# Altium schematic sheet TCAN1146_PWR_MGMT.SchDoc
size C; SheetNumber: 3; SheetTotal: 7
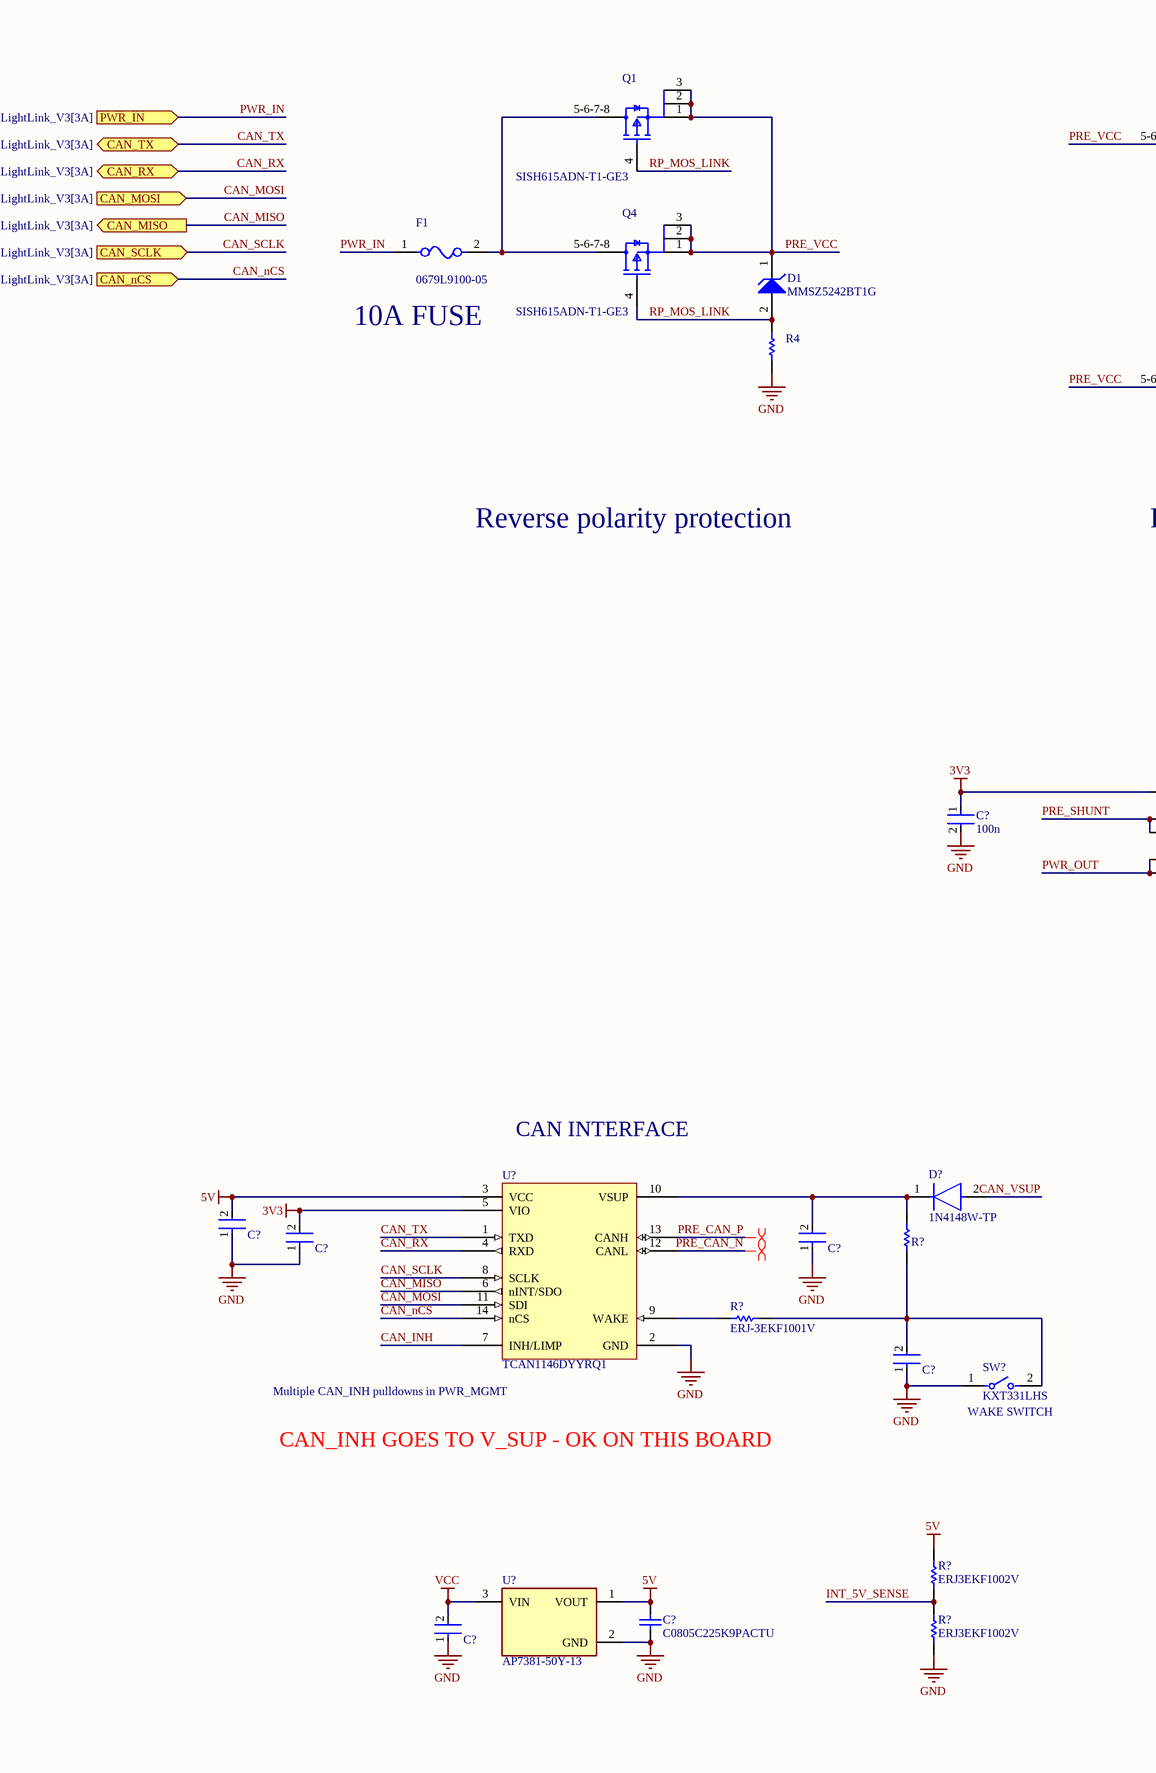
[diagram p0: TCAN1146_PWR_MGMT.SchDoc, left]
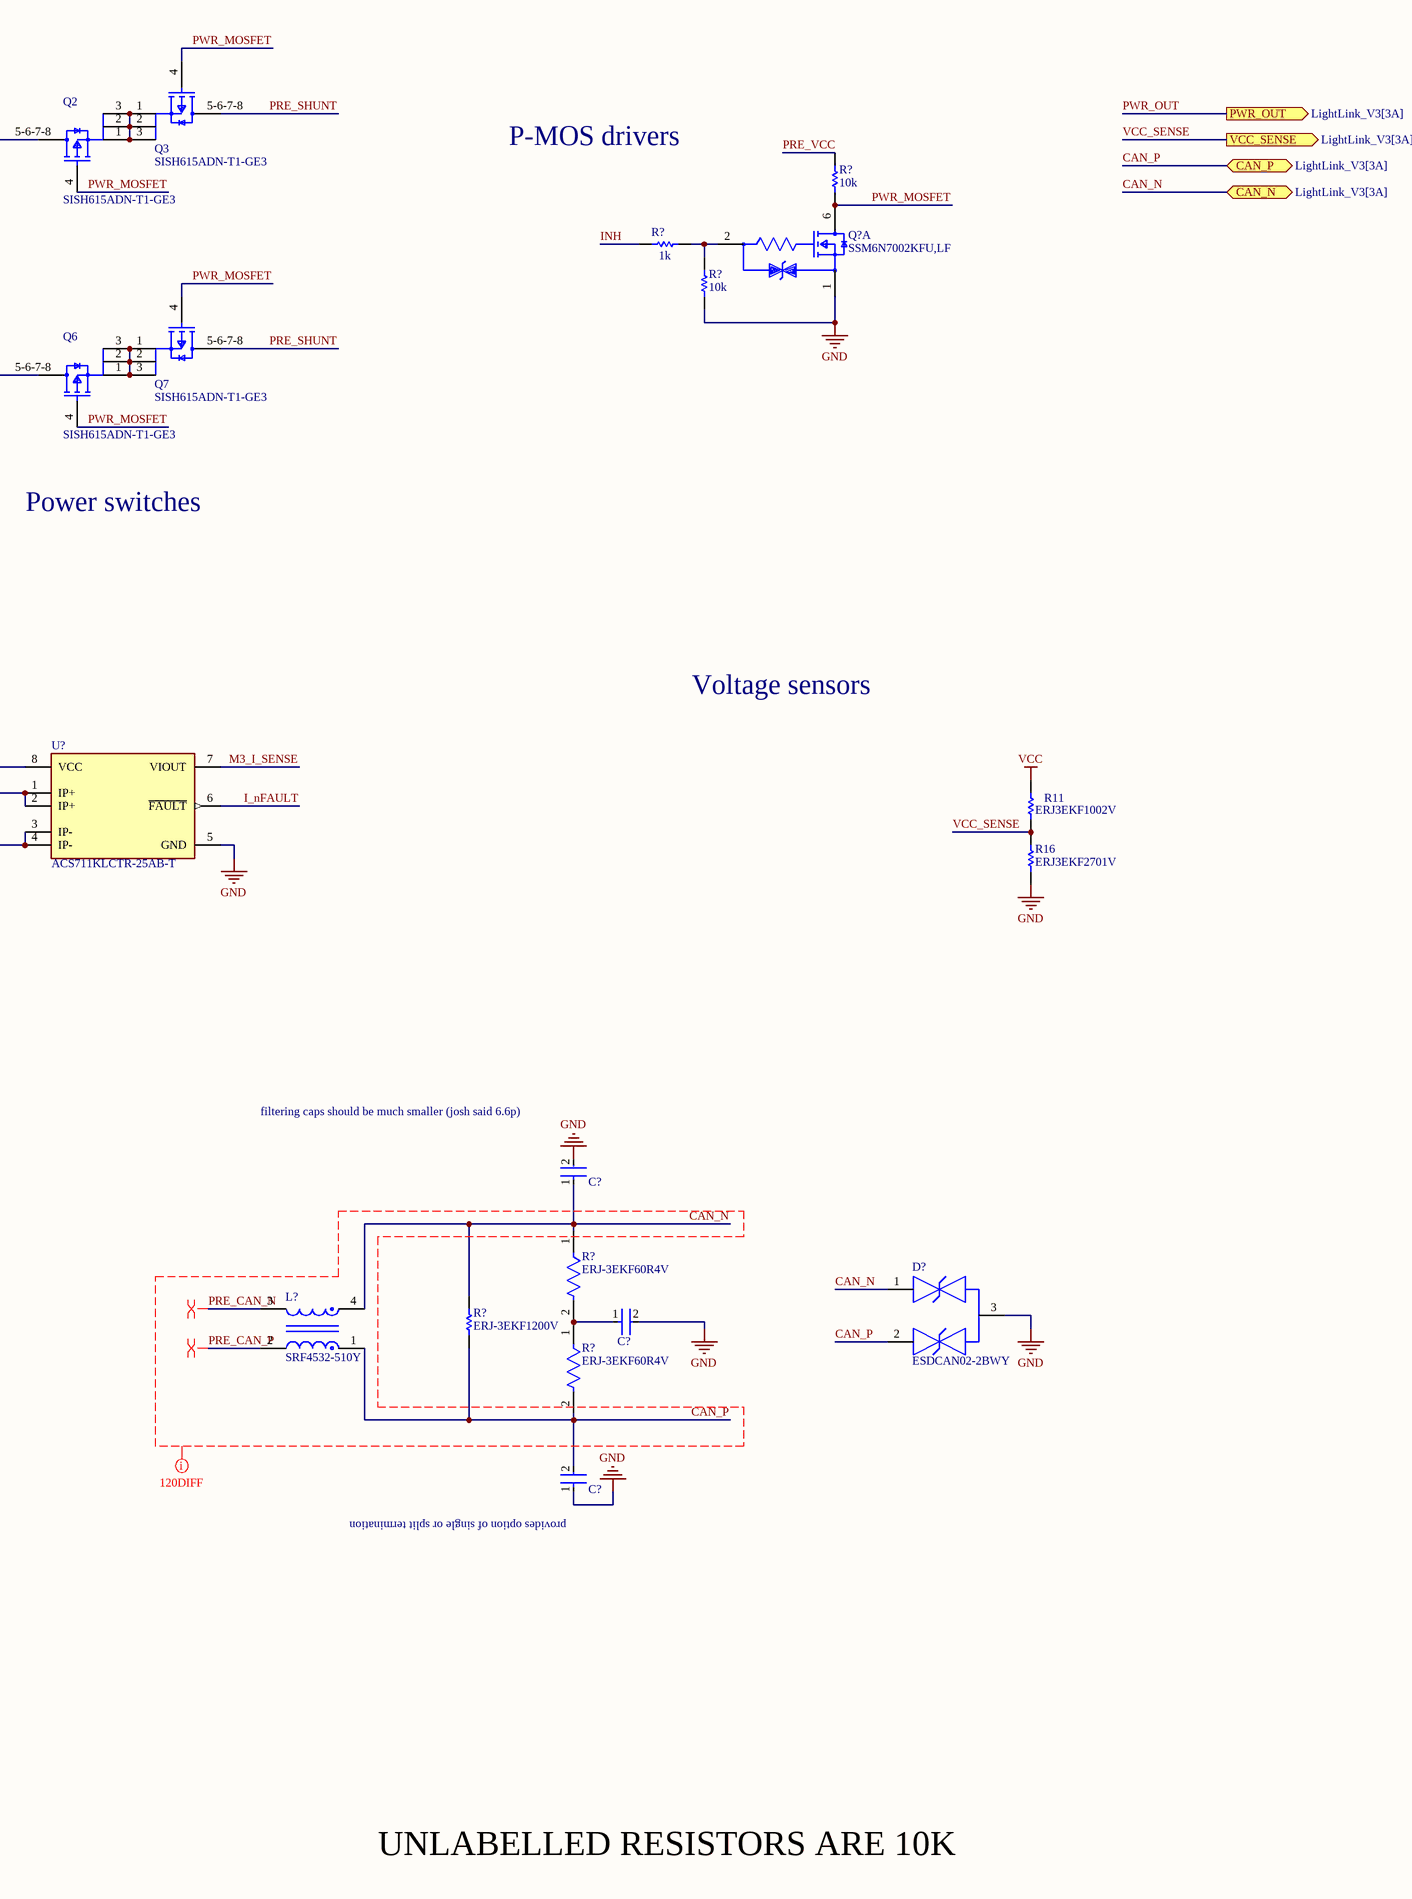
[diagram p1: TCAN1146_PWR_MGMT.SchDoc, right]

## Parts
(Parts that share a designator on the sheet are numbered #1, #2 ... from top to bottom, then left to right.)
C?#1  100n  [FP-0402-L_1_0_0_05-W_0_5-IPC_A]
C?#2  C0402C104K8PACTU  [FP-C0402-BB-MFG]  (value not drawn)
C?#3  C0402C104K8PACTU  [FP-C0402-BB-MFG]  (value not drawn)
C?#4  C0402C104K8PACTU  [FP-C0402-BB-MFG]  (value not drawn)
C?#5  C0402C104K8PACTU  [FP-C0402-BB-MFG]  (value not drawn)
C?#6  C0402C104K8PACTU  [FP-C0402-BB-MFG]  (value not drawn)
C?#7  C0402C104K8PACTU  [FP-C0402-BB-MFG]  (value not drawn)
C?#8  C0402C104K8PACTU  [FP-C0402-BB-MFG]  (value not drawn)
C?#9  C0805C225K9PACTU  [CAPC2013X145X50ML20T25]
C?#10  C0402C104K8PACTU  [FP-C0402-BB-MFG]  (value not drawn)
D1  MMSZ5242BT1G  [ONSC-SOD-123-2-425-04_V]
D?#1  1N4148W-TP  [FP-SOD-123-IPC_A]
D?#2  ESDCAN02-2BWY  [FP-SOT323-3L-MFG]
F1  0679L9100-05  [FP-0679L-MFG]
L?  SRF4532-510Y  [FP-SRF4532-MFG]
Q1  SISH615ADN-T1-GE3  [SISH615ADN-T1-GE3-Footprint-1]
Q2  SISH615ADN-T1-GE3  [SISH615ADN-T1-GE3-Footprint-1]
Q3  SISH615ADN-T1-GE3  [SISH615ADN-T1-GE3-Footprint-1]
Q4  SISH615ADN-T1-GE3  [SISH615ADN-T1-GE3-Footprint-1]
Q6  SISH615ADN-T1-GE3  [SISH615ADN-T1-GE3-Footprint-1]
Q7  SISH615ADN-T1-GE3  [SISH615ADN-T1-GE3-Footprint-1]
Q?  SSM6N7002KFU,LF  [FP-SSOP6-P-0_65A-MFG]  (part A of 2)
R4  ERJ3EKF1002V  [RESC1609X55X30LL15T15]  (value not drawn)
R11  ERJ3EKF1002V  [RESC1609X55X30LL15T15]
R16  ERJ3EKF2701V  [RESC1608X55X30LL15T15]
R?#1  10k  [R0805A]
R?#2  1k  [R0805A]
R?#3  10k  [R0805A]
R?#4  ERJ3EKF1002V  [RESC1609X55X30LL15T15]  (value not drawn)
R?#5  ERJ-3EKF60R4V  [FP-ERJ3EK-IPC_C]
R?#6  ERJ-3EKF1001V  [RESC1608X55X30LL15T15]
R?#7  ERJ-3EKF1200V  [RESC1609X55X30ML15T15]
R?#8  ERJ-3EKF60R4V  [FP-ERJ3EK-IPC_C]
R?#9  ERJ3EKF1002V  [RESC1609X55X30LL15T15]
R?#10  ERJ3EKF1002V  [RESC1609X55X30LL15T15]
SW?  KXT331LHS  [FP-KXT331LHS-MFG]
U?#1  ACS711KLCTR-25AB-T  [FP-LC-8-IPC_A]
U?#2  TCAN1146DYYRQ1  [TCAN1146DYYRQ1-Footprint-1]
U?#3  AP7381-50Y-13  [FP-SOT89-MFG]

## Ports
CAN_MISO (out, see LightLink_V3[3A]), CAN_MOSI (in, see LightLink_V3[3A]), CAN_N (bidir, see LightLink_V3[3A]), CAN_nCS (in, see LightLink_V3[3A]), CAN_P (bidir, see LightLink_V3[3A]), CAN_RX (bidir, see LightLink_V3[3A]), CAN_SCLK (in, see LightLink_V3[3A]), CAN_TX (bidir, see LightLink_V3[3A]), PWR_IN (in, see LightLink_V3[3A]), PWR_OUT (out, see LightLink_V3[3A]), VCC_SENSE (out, see LightLink_V3[3A])

## Nets
3V3: C?#1.1 C?#4.2 U?#1.8(VCC) U?#2.5(VIO)
5V: C?#3.2 C?#9.2 R?#9.2 U?#2.3(VCC) U?#3.1(VOUT)
GND: C?#1.2 C?#2.2 C?#3.1 C?#4.1 C?#5.1 C?#6.2 C?#7.1 C?#8.1 C?#9.1 C?#10.1 D?#2.3 Q?.1(Source1) R4.2 R16.1 R?#3.1 R?#10.2 SW?.1 U?#1.5(GND) U?#2.2(GND) U?#3.2(GND)
VCC: C?#10.2 R11.1 U?#3.3(VIN)
CAN_INH: U?#2.7(INH/LIMP)
CAN_MISO: U?#2.6(nINT/SDO) ; port CAN_MISO
CAN_MOSI: U?#2.11(SDI) ; port CAN_MOSI
CAN_N: C?#2.1 D?#2.1 L?.4 R?#5.1 R?#7.1 ; port CAN_N
CAN_nCS: U?#2.14(nCS) ; port CAN_nCS
CAN_P: C?#8.2 D?#2.2 L?.1 R?#7.2 R?#8.2 ; port CAN_P
CAN_RX: U?#2.4(RXD) ; port CAN_RX
CAN_SCLK: U?#2.8(SCLK) ; port CAN_SCLK
CAN_TX: U?#2.1(TXD) ; port CAN_TX
CAN_VSUP: D?#1.2(A)
I_nFAULT: U?#1.6(~{FAULT})
INH: R?#2.1
INT_5V_SENSE: R?#9.1 R?#10.1
M3_I_SENSE: U?#1.7(VIOUT)
PRE_CAN_N: L?.3 U?#2.12(CANL)
PRE_CAN_P: L?.2 U?#2.13(CANH)
PRE_SHUNT: Q3.5-6-7-8(D) Q7.5-6-7-8(D) U?#1.1(IP+) U?#1.2(IP+)
PRE_VCC: D1.1(K) Q1.1(S) Q1.2(S) Q1.3(S) Q2.5-6-7-8(D) Q4.1(S) Q4.2(S) Q4.3(S) Q6.5-6-7-8(D) R?#1.2
PWR_IN: F1.1 ; port PWR_IN
PWR_MOSFET: Q2.4(G) Q3.4(G) Q6.4(G) Q7.4(G) Q?.6(Drain1) R?#1.1
PWR_OUT: U?#1.3(IP-) U?#1.4(IP-) ; port PWR_OUT
RP_MOS_LINK: D1.2(A) Q1.4(G) Q4.4(G) R4.1
VCC_SENSE: R11.2 R16.2 ; port VCC_SENSE
NetC?#5_2: C?#5.2 D?#1.1(C) R?#4.1 U?#2.10(VSUP)
NetC?#6_1: C?#6.1 R?#5.2 R?#8.1
NetC?#7_2: C?#7.2 R?#4.2 R?#6.2 SW?.2
NetF1_2: F1.2 Q1.5-6-7-8(D) Q4.5-6-7-8(D)
NetQ2_1: Q2.1(S) Q2.2(S) Q2.3(S) Q3.1(S) Q3.2(S) Q3.3(S)
NetQ6_1: Q6.1(S) Q6.2(S) Q6.3(S) Q7.1(S) Q7.2(S) Q7.3(S)
NetQ?_2: Q?.2(Gate1) R?#2.2 R?#3.2
NetR?#6_1: R?#6.1 U?#2.9(WAKE)

## Layout directives
differential pair: PRE_CAN_N, PRE_CAN_P
net class 120DIFF: CAN_N, CAN_P, PRE_CAN_N, PRE_CAN_P

## Notes on the sheet
- P-MOS drivers
- (near F1) 10A FUSE
- Reverse polarity protection
- Power switches
- Voltage sensors
- CAN INTERFACE
- (near C?#2) filtering caps should be much smaller (josh said 6.6p)
- (near U?#2) Multiple CAN_INH pulldowns in PWR_MGMT
- (near SW?) WAKE SWITCH
- CAN_INH GOES TO V_SUP - OK ON THIS BOARD
- (near C?#8) provides option of single or split termination
- UNLABELLED RESISTORS ARE 10K

## Library data of the parts
C?#1 = CMP-001-00058-1: LARGE PADS, 0402 CAP, CHANGE COMMENT TO MATCH REAL P/N; Capacitor Type: Ceramic; Min Operating Temperature: -55°C; Mounting Technology: Surface Mount; Pins: 2; Case/Package: 0402; RoHS Compliant: Yes; Max Operating Temperature: 85°C
C?#2-C?#8 C?#10 = CMP-2008-02046-2: CAP CER 0.1UF 10V X5R 0402; Manufacturer: Kemet; Material: Ceramic; Capacitance: 0.10 μF; Temperature Coefficient: 15%; Tolerance: 0.1; Value: 0.10 μF; Package: C0402-BB; Temperature: -55°C to +125°C; ComponentLink2Description: Datasheet; Temperature Characteristic: X5R; Device Class L1: Passive Components; Height: 0.55mm; Lead Free: Yes; ComponentLink2URL: https://content.kemet.com/datasheets/KEM_C1002_X7R_SMD.pdf; Device Class L2: Capacitors; Temperature Range Low: -55°C; Temperature Range High: +125°C; RoHS: TRUE; Octopart: https://octopart.com/c0402c104k8pactu-kemet-140039; Automotive: No; Mouser Description: Capacitor 100 nF 10 VDC 0402; Category: Cap; Voltage Rating: 10 V; Digikey Description: CAP CER 0.1UF 10V X5R 0402; Ipc Land Pattern Name: CAPC10050X50; Device Class L3: Ceramic Capacitors; Manufacturer Part Number: C0402C104K8PACTU
C?#9 = CMP-1036-04819-2: Manufacturer: Kemet; Part Number: C0805C225K9PACTU
D1 = CMP-1060-00565-1: Zener Voltage Regulator, 500 mW, 2-Pin SOD-123, Pb-Free, Tape and Reel; Manufacturer: On Semiconductor; P Max (W): 0.5; VZ Typ (V): 12; PartNumber: MMSZ5242BT1G; PackageReference: SOD-123-2-425-04; ComponentLink3URL: http://www.onsemi.com/pub_link/Collateral/425-04.PDF; Mounting Technology: Surface Mount; ComponentLink2Description: Datasheet; ComponentLink1URL: http://www.onsemi.com/; ComponentLink3Description: Package Specification; PackageDescription: 2-Pin SOD, Body 1.6 x 2.69 mm; PackageVersion: Rev. G, 10/2009; ComponentLink1Description: Manufacturer URL; RoHS: Pb-Free; ComponentLink2URL: http://www.onsemi.com/pub_link/Collateral/MMSZ5221BT1-D.PDF; Packing: Tape and Reel; DatasheetVersion: Rev. 12
D?#1 = CMP-2000-04993-2: DIODE GEN PURP 100V 150MA SOD123; Max Reverse Leakage Current: 5uA; Max Surge Current: 2A; Reverse Recovery Time: 4ns; Polarity: Standard; Capacitance: 4pF; Max Forward Surge Current (Ifsm): 1A; Element Configuration: Single; Power Dissipation: 400mW; Forward Voltage: 1V; Radiation Hardening: No; Lead Free: Lead Free; Max Reverse Voltage (DC): 100V; Current Rating: 150mA; Forward Current: 150mA; Packaging: Tape and Reel; Number of Pins: 2; Package Quantity: 3000; Max Operating Temperature: 150°C; Min Operating Temperature: -65°C; Average Rectified Current: 150mA; Recovery Time: 4ns; Output Current: 150mA; Peak Non-Repetitive Surge Current: 2A; Width: 1.8mm; Voltage Rating (DC): 100V; Height: 1.2mm; Max Repetitive Reverse Voltage (Vrrm): 100V; Mount: Surface Mount; Length: 2.85mm
D?#2 = CMP-12225-000055-1: TVS DIODE 26.5V 44V SOT323-3; Manufacturer: STMicroelectronics; Value: 3pF; Direction: Bidirectional; Breakdown Voltage: 28.5V; Automotive Grade: Grade 0; Standoff Height: 0mm; Peak Pulse Power: 170W; Peak Pulse Current: 3A; Number Of Channels: 2; Max Junction Temp: +175°C; Mouser Description: TVS Diodes / ESD Suppressors Automotive dual-line Transil, Transient voltage suppressor (TVS) for CAN bus; Height: 1.1mm; Category: Diode; Reverse Standoff Voltage: 26.5V; Device Class L1: Circuit Protection; Temperature: -55°C to +175°C; RoHS: TRUE; ComponentLink2URL: https://www.st.com/resource/en/datasheet/esdcan02-2bwy.pdf; Device Class L3: unset; Device Class L2: TVS Diodes; Temperature Range High: +175°C; Octopart: https://octopart.com/esdcan02-2bwy-stmicroelectronics-58631133; Ipc Land Pattern Name: SOT65P210X95-3; Temperature Range Low: -55°C; Capacitance: 3pF; Digikey Description: TVS DIODE 26.5V 44V SOT323-3; Automotive: Yes; ComponentLink2Description: Datasheet; Clamping Voltage: 44V; Manufacturer Part Number: ESDCAN02-2BWY; Lead Free: Yes; Package: SOT323-3L
F1 = CMP-16042-000002-1: DIFF P#!!! / FUSE BRD MNT 10A 125VAC/VDC; Manufacturer: Bel Fuse; Manufacturer Part Number: 0679L9150-01; Max Fuse Ac Voltage: 125V; Fuse Blow Speed: Fast; Fuse Current: 15A; Fuse I2T: 103.5A2Sec; Fuse Interrupt Ac Current: 50A; Automotive Grade: Grade 1; Value: 0.0038Ω; Fuse Interrupt Dc Current: 300A; Fuse Voltage Drop: 0.13V; Device Class L2: Fuses; ComponentLink2URL: https://www.belfuse.com/resources/CircuitProtection/datasheets/0679L%20Sep2016.pdf; Package: 0679L; Height: 2.79mm; Digikey Description: FUSE BRD MNT 15A 125VAC/VDC; Temperature Range High: +125°C; Device Class L3: unset; Octopart: https://octopart.com/0679l9150-01-bel+fuse-70850665; Temperature Range Low: -55°C; Max Fuse Dc Voltage: 125V; Ipc Land Pattern Name: CAPC610254X254; Category: Fuse; Lead Free: Yes; Automotive: Yes; Resistance: 0.0038Ω; RoHS: TRUE; Device Class L1: Circuit Protection; ComponentLink2Description: Datasheet; Temperature: -55°C to +125°C; Voltage Rating: 125V
L? = CMP-07251-000006-1: CMC 51UH 200MA 2LN 2KOHM SMD; Element Configuration: Dual; Number of Lines: 2; Core Material: Ferrite; Impedance: 2kR; Test Frequency: 100kHz; Voltage Rating (DC): 50V; Insulation Resistance: 10MR; Material: Steel; Tolerance: 50%; DC Resistance (DCR): 3.5R; RoHS Compliant: Yes; Mount: Surface Mount; REACH SVHC: No SVHC; Termination: SMD/SMT; DC Current: 200mA; Current: 200mA; Lead Free: Lead Free; Contact Plating: Tin; Length: 4.5mm; Max DC Current: 200mA; Width: 0.126inch; Case/Package: 4532; Packaging: Tape and Reel; Package Quantity: 1; Min Operating Temperature: -40°C; Depth: 3.4mm; Series: SRF4532; Max Operating Temperature: 125°C; Current Rating: 200mA; Self Resonant Frequency: 100kHz; Height: 0.118inch; Inductance: 51uH; Resistance: 2kR
Q1-Q4 Q6 Q7 = CMP-013-00036-2: Trans MOSFET P-CH 20V 22.1A 8-Pin PowerPAK 1212 EP T/R
Q? = CMP-35916-000009-1: MOSFET 2N-CH 60V 0.3A; Input Capacitance: 40pF; Continuous Drain Current (ID): 300mA; Max Power Dissipation: 285mW; FET Type: 2 N-Channel; Rds On Max: 1.5R; Mount: Surface Mount; Drain to Source Voltage (Vdss): 60V; Packaging: Tape and Reel
R4 R11 R?#4 R?#9 R?#10 = CMP-1012-00623-3: Chip Resistor, 10 KOhm, +/- 1%, 0.1 W, -55 to 155 degC, 0603 (1608 Metric), RoHS, Tape and Reel; Manufacturer: Panasonic; Voltage Rating: 75V; Case\/Package: 0603; Power Rating: 100mW; Resistance: 10KOhm; Temperature Coefficient: 100ppm\/degreesC; Number of Pins: 2; Package Reference: 603; Depth: 0.8mm; Mount: SurfaceMount; Package Description: 2-Pin Surface Mount Device, Body 1.6 x 0.85 mm; Datasheet Version: 02/2017; Length: 1.6mm; Lead Free: LeadFree; Height: 0.45mm; Number of Terminations: 2; Max Power Dissipation: 100mW; Min Operating Temperature: -55degC; Datasheet URL: https://industrial.panasonic.com/cdbs/www-data/pdf/RDA0000/AOA0000C304.pdf; Termination: SMD/SMT; Case Code (Metric): 1608; Case Code (Imperial): 0603; Tolerance: 1%; Max Operating Temperature: 155degC; RoHSCompliant: true; Voltage Rating (DC): 75V; Radiation Hardening: No; Packaging: TapeandReel; Composition: ThickFilm; Mounting Technology: SurfaceMount; Manufacturer URL: http://www.panasonic.com/; Width: 0.031inch; REACH SVHC: NoSVHC; Contact Plating: Tin; Military Standard: Not; Package Quantity: 1
R16 = CMP-2000-00389-1: Manufacturer: Panasonic; Part Number: ERJ3EKF2701V
R?#1-R?#3 = CMP-009-00002-14: Resistor
R?#5 R?#8 = CMP-1012-00372-3: RES SMD 60.4 OHM 1% 1/10W 0603; Resistance: 60.4R; Voltage Rating (DC): 50V; Voltage Rating: 75V; Temperature Coefficient: 100ppm/°C; Power Rating: 100mW; Mount: Surface Mount; Number of Terminations: 2; Max Operating Temperature: 155°C; Case Code (Metric): 1608; Height: 0.022inch; Case/Package: 0603; Min Operating Temperature: -55°C; REACH SVHC: No SVHC; Series: ERJ; Features: Automotive AEC-Q200; Military Standard: Not; Lead Free: Lead Free; Width: 0.031inch; Case Code (Imperial): 0603; Resistance Tolerance: 1%; Packaging: Tape and Reel; Termination: SMD/SMT; Tolerance: 1%; Contact Plating: Tin; Depth: 0.8mm; Resistor Type: Thick Film; Construction: Rectangular; RoHS Compliant: Yes; Max Power Dissipation: 100mW; Package Quantity: 1; Length: 1.6mm
R?#6 = CMP-2000-00180-1: Manufacturer: Panasonic; Part Number: ERJ-3EKF1001V
R?#7 = CMP-2000-00213-2: Chip Resistor, 120 Ohm, +/- 1%, 0.1 W, -55 to 155 degC, 0603 (1608 Metric), RoHS, Tape and Reel; Manufacturer: Panasonic; Power Rating: 100mW; Voltage Rating (DC): 75V; Resistance: 120Ohm; Temperature Coefficient: 100ppm/degreesC; Number of Terminations: 2; Military Standard: Not; Tolerance: 1%; Min Operating Temperature: -55degC; Packaging: TapeandReel; Lead Free: LeadFree; Max Operating Temperature: 155degC; Manufacturer URL: http://www.panasonic.com/; Case Code (Imperial): 0603; REACH SVHC: NoSVHC; Width: 0.031inch; Datasheet URL: https://industrial.panasonic.com/cdbs/www-data/pdf/RDA0000/AOA0000C283.pdf; RoHSCompliant: true; Max Power Dissipation: 100mW; Termination: SMD/SMT; Package Reference: 0603; Height: 0.022inch; Depth: 0.8mm; Package Description: 2-Pin Surface Mount Device, Body 1.6 x 0.85 mm; Contact Plating: Tin; Length: 1.6mm; Package URL: http://www.st.com/st-web-ui/static/active/en/resource/technical/document/datasheet/CD00001320.pdf; Radiation Hardening: No; Package Quantity: 1; Number of Pins: 2; Datasheet Version: 42095.0; Voltage Rating: 75V; Composition: ThickFilm; Case/Package: 0603; Mount: SurfaceMount; Case Code (Metric): 1608
SW? = CMP-10040-000029-1: SWITCH TACTILE SPST-NO 0.02A 15V; Operating Force: 240gf; Switch Travel: 0.13mm; Illumination Type: Non-Illuminated; Throw Configuration: SPST; Number of Ports: 1; Current Rating: 5A; Mechanical Life: 500000Cycles; Switch Function: Off-Mom; Connector Type: USB; Actuator Type: Standard; Gender: Receptacle; Number of Contacts: 24; Contact Plating: Gold; Insulation Color: Black; Min Operating Temperature: -40°C; Packaging: Tape and Reel; Flammability Rating: UL94 V-0; Max Operating Temperature: 85°C; Termination: Solder; Mount: Surface Mount
U?#1 = CMP-1557-00015-2: SENSOR CURRENT HALL 25A AC/DC; Bandwidth: 100kHz; Min Supply Voltage: 3V; Polarity: Bidirectional; Max Supply Voltage: 5.5V; Max Supply Current: 5.5mA; Number of Channels: 1; Quiescent Current: 4mA; Sensitivity: 55mV/A; Accuracy: 4%; Linearity: 1%; Operating Supply Voltage: 3.3V; Response Time: 4.6us; Case/Package: SOIC; Min Operating Temperature: -40°C; RoHS Compliant: Yes; Length: 4.9mm; Package Quantity: 1; Number of Pins: 8; Width: 3.9mm; REACH SVHC: No SVHC; -3db Bandwidth: 100kHz; Series: -; Packaging: Tape and Reel; Max Operating Temperature: 125°C; Current Sensing: 25A; Height: 1.5mm; Frequency: 100kHz
U?#2 = CMP-015-00012-2: Automotive CAN FD transceiver with watchdog, bus diagnostics and partial networking via sele 14-SOT-23-THIN -40 to 150
U?#3 = CMP-12756-000009-1: IC REG LINEAR 5V 150MA SOT89; Manufacturer: Diodes Inc.; Output Type: Fixed; Min Supply Voltage: 3.3V; Max Junction Temp: +125°C; Max Supply Voltage: 40V; Nominal Supply Current: 2.5-25uA; Number Of Outputs: 1; Dropout Voltage: 1000mV; Manufacturer Part Number: AP7381-50Y-13; RoHS: TRUE; Digikey Description: IC REG LINEAR 5V 150MA SOT89; Output Voltage: 5V; Footprint Url: https://www.diodes.com/assets/Package-Files/SOT89.pdf; Category: IC; Temperature: -40°C to +125°C; ComponentLink2Description: Datasheet; Package: SOT89; Temperature Range Low: -40°C; Temperature Range High: +125°C; ComponentLink2URL: https://www.diodes.com/assets/Datasheets/AP7381.pdf; Device Class L1: Integrated Circuits (ICs); Automotive: No; Output Current: 150mA; Ambient Temperature Range High: +85°C; Octopart: https://octopart.com/ap7381-50y-13-diodes+inc.-87775116; Lead Free: Yes; Device Class L2: Power Management ICs; Height: 1.6mm; Device Class L3: Voltage Regulators - Linear; Ambient Temperature Range Low: -40°C